# EAGLE design T04_Display_Branden (EAGLE 7.1.0)
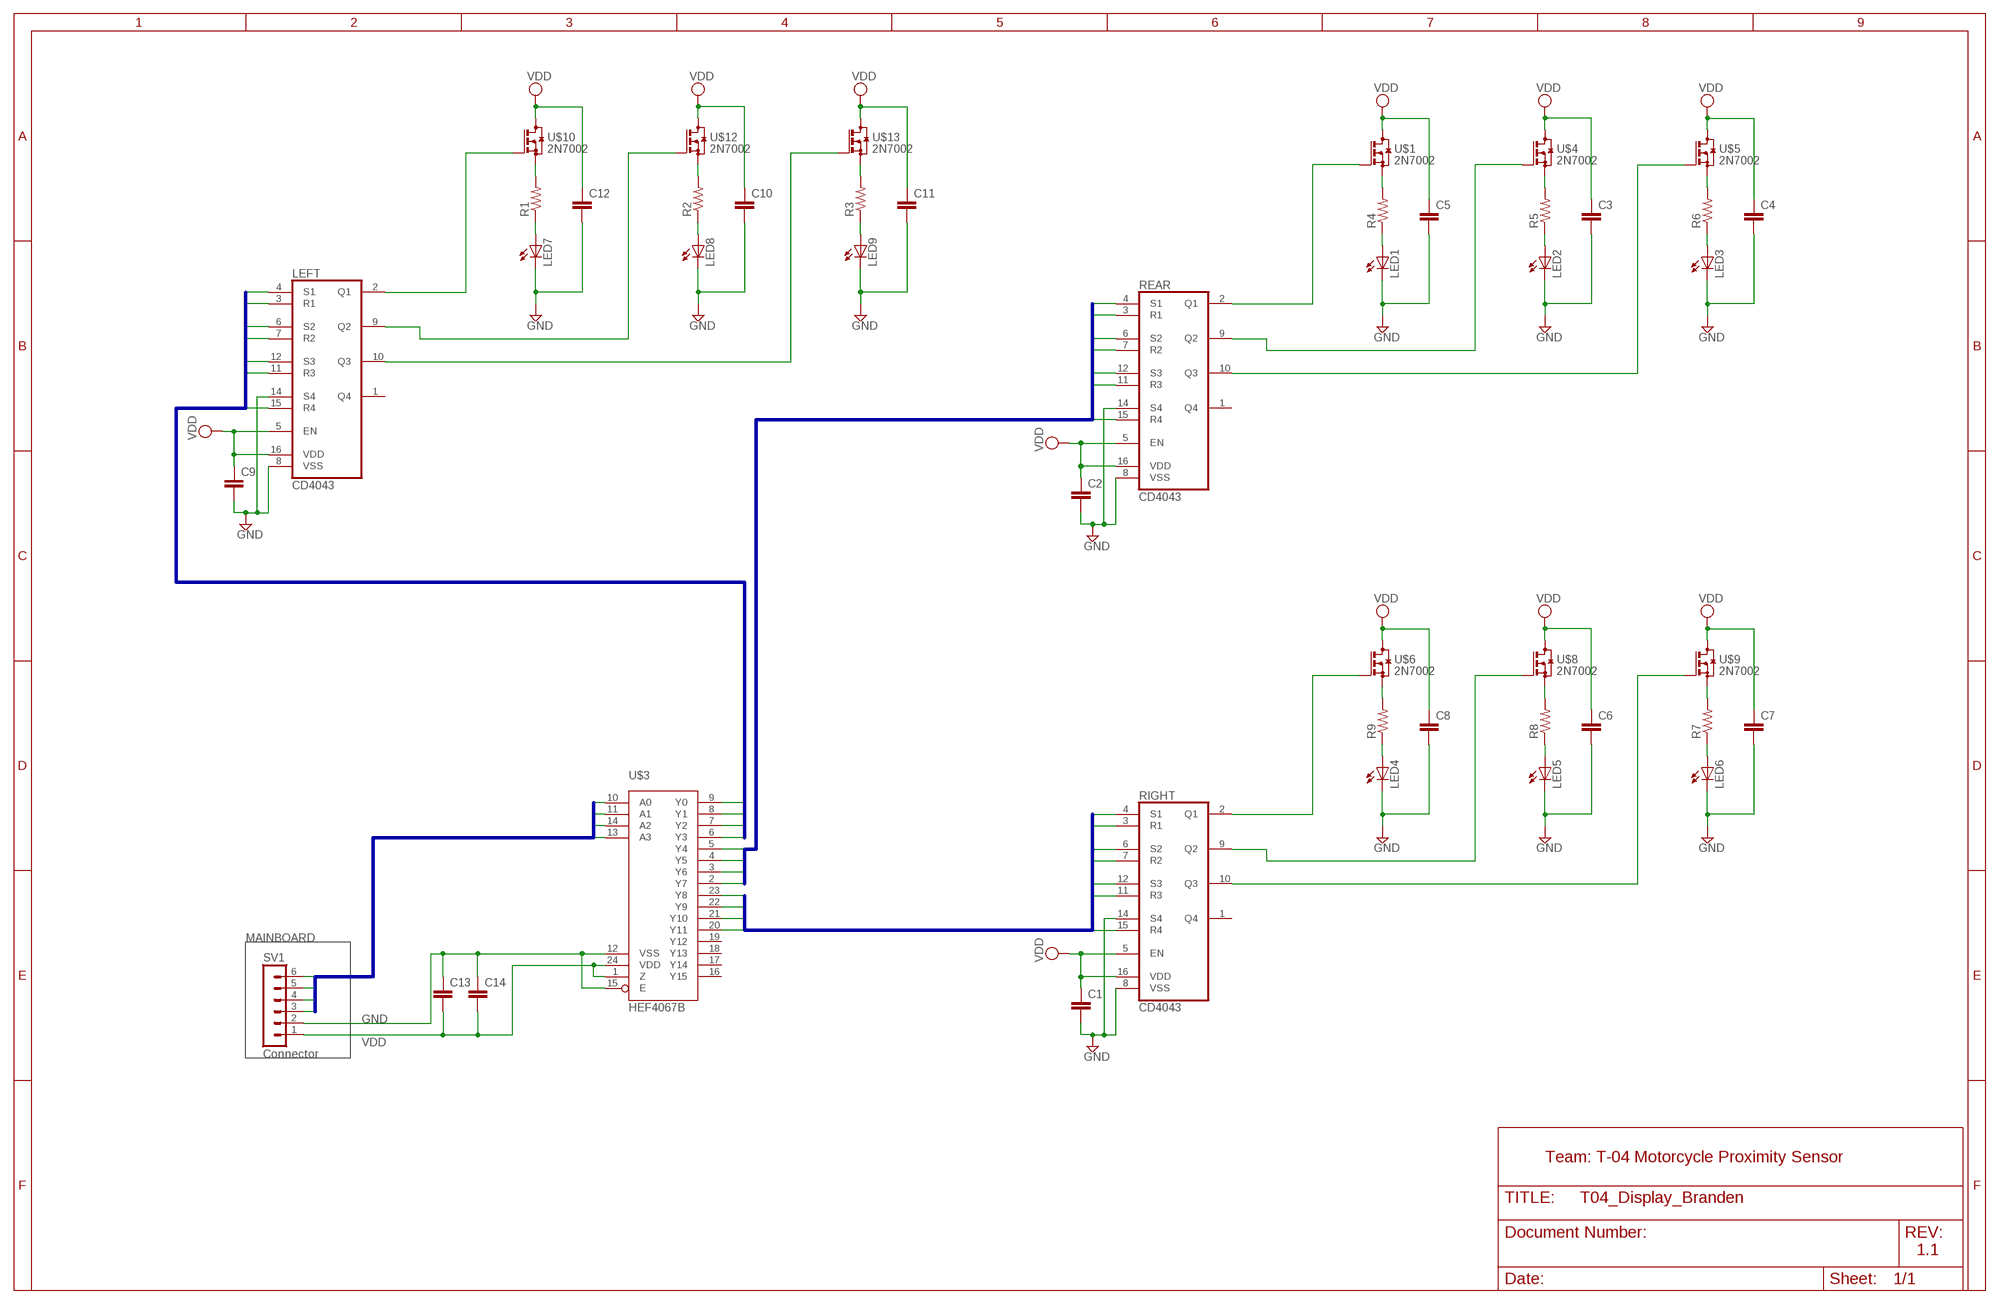
[diagram p0: schematic, sheet 1]

## Parts
C1  C-EUC1206  [C1206]
C2  C-EUC1206  [C1206]
C3  C-EUC1206  [C1206]
C4  C-EUC1206  [C1206]
C5  C-EUC1206  [C1206]
C6  C-EUC1206  [C1206]
C7  C-EUC1206  [C1206]
C8  C-EUC1206  [C1206]
C9  C-EUC1206  [C1206]
C10  C-EUC1206  [C1206]
C11  C-EUC1206  [C1206]
C12  C-EUC1206  [C1206]
C13  C-EUC1206  [C1206]
C14  C-EUC1206  [C1206]
LED1  LED3MM  [LED3MM]
LED2  LED3MM  [LED3MM]
LED3  LED3MM  [LED3MM]
LED4  LED3MM  [LED3MM]
LED5  LED3MM  [LED3MM]
LED6  LED3MM  [LED3MM]
LED7  LED3MM  [LED3MM]
LED8  LED3MM  [LED3MM]
LED9  LED3MM  [LED3MM]
LEFT  CD4043  [SOIC16N]
R1  R-US_R1206  [R1206]
R2  R-US_R1206  [R1206]
R3  R-US_R1206  [R1206]
R4  R-US_R1206  [R1206]
R5  R-US_R1206  [R1206]
R6  R-US_R1206  [R1206]
R7  R-US_R1206  [R1206]
R8  R-US_R1206  [R1206]
R9  R-US_R1206  [R1206]
REAR  CD4043  [SOIC16N]
RIGHT  CD4043  [SOIC16N]
SV1  Connector  MA06-1  [MA06-1]
U$1  2N7002  [SOT23]
U$3  HEF4067B  [SO24W]
U$4  2N7002  [SOT23]
U$5  2N7002  [SOT23]
U$6  2N7002  [SOT23]
U$8  2N7002  [SOT23]
U$9  2N7002  [SOT23]
U$10  2N7002  [SOT23]
U$12  2N7002  [SOT23]
U$13  2N7002  [SOT23]

## Nets
A0: SV1.6 U$3.10(A0)
A1: SV1.5 U$3.11(A1)
A2: SV1.4 U$3.14(A2)
A3: SV1.3 U$3.13(A3)
BG: LEFT.2(Q1) U$10.1(G)
BR: LEFT.10(Q3) U$13.1(G)
BRES: LEFT.3(R1) LEFT.7(R2) LEFT.11(R3) LEFT.15(R4) U$3.6(Y3)
BS1: LEFT.4(S1) U$3.9(Y0)
BS2: LEFT.6(S2) U$3.8(Y1)
BS3: LEFT.12(S3) U$3.7(Y2)
BY: LEFT.9(Q2) U$12.1(G)
GND: C1.2 C2.2 C3.2 C4.2 C5.2 C6.2 C7.2 C8.2 C9.2 C10.2 C11.2 C12.2 C13.1 C14.1 LED1.K(C) LED2.K(C) LED3.K(C) LED4.K(C) LED5.K(C) LED6.K(C) LED7.K(C) LED8.K(C) LED9.K(C) LEFT.8(VSS) LEFT.14(S4) REAR.8(VSS) REAR.14(S4) RIGHT.8(VSS) RIGHT.14(S4) SV1.2 U$3.12(VSS) U$3.15(E)
LG: REAR.2(Q1) U$1.1(G)
LR: REAR.10(Q3) U$5.1(G)
LRES: REAR.3(R1) REAR.7(R2) REAR.11(R3) REAR.15(R4) U$3.2(Y7)
LS1: REAR.4(S1) U$3.5(Y4)
LS2: REAR.6(S2) U$3.4(Y5)
LS3: REAR.12(S3) U$3.3(Y6)
LY: REAR.9(Q2) U$4.1(G)
N$1: R5.2 U$4.2(S)
N$2: R8.2 U$8.2(S)
N$3: R6.2 U$5.2(S)
N$4: R4.2 U$1.2(S)
N$5: LED1.A R4.1
N$6: LED3.A R6.1
N$7: R9.2 U$6.2(S)
N$8: LED4.A R9.1
N$9: LED5.A R8.1
N$10: LED2.A R5.1
N$11: R7.2 U$9.2(S)
N$12: LED6.A R7.1
N$13: R1.2 U$10.2(S)
N$14: LED7.A R1.1
N$15: R2.2 U$12.2(S)
N$16: LED8.A R2.1
N$17: R3.2 U$13.2(S)
N$18: LED9.A R3.1
RG: RIGHT.2(Q1) U$6.1(G)
RR: RIGHT.10(Q3) U$9.1(G)
RRES: RIGHT.3(R1) RIGHT.7(R2) RIGHT.11(R3) RIGHT.15(R4) U$3.20(Y11)
RS1: RIGHT.4(S1) U$3.23(Y8)
RS2: RIGHT.6(S2) U$3.22(Y9)
RS3: RIGHT.12(S3) U$3.21(Y10)
RY: RIGHT.9(Q2) U$8.1(G)
VDD: C1.1 C2.1 C3.1 C4.1 C5.1 C6.1 C7.1 C8.1 C9.1 C10.1 C11.1 C12.1 C13.2 C14.2 LEFT.5(EN) LEFT.16(VDD) REAR.5(EN) REAR.16(VDD) RIGHT.5(EN) RIGHT.16(VDD) SV1.1 U$1.3(D) U$3.1(Z) U$3.24(VDD) U$4.3(D) U$5.3(D) U$6.3(D) U$8.3(D) U$9.3(D) U$10.3(D) U$12.3(D) U$13.3(D)
Unconnected: LEFT.1(Q4) REAR.1(Q4) RIGHT.1(Q4) U$3.16(Y15) U$3.17(Y14) U$3.18(Y13) U$3.19(Y12)

## Buses
BS1,BS2,BS3,BRES
LS1,LS2,LS3,LRES
RS1,RS2,RS3,RRES
A0,A1,A2,A3

## Notes on the sheet
- MAINBOARD
- Team: T-04 Motorcycle Proximity Sensor
- 1.1

## Library data of the parts
C1-C14 = resistor:C-EU: CAPACITOR, European symbol; SPICEPREFIX: C
LED1-LED9 = display:LED: LED OSRAM: - CHIPLED LG R971, LG N971, LY N971, LG Q971, LY Q971, LO R971, LY R971 LH N974, LH R974 LS Q976, LO Q976, LY Q976 LO Q996 - Hyper CHIPLED LW Q18S LB Q993, LB Q99A, LB R99A - SideLED LS A670, LO A670, LY A670, LG A670, LP A670 LB A673, LV A673, LT A673, LW A673 LH A674 LY A675 LS A676, LA A676, LO A676, LY A676, LW A676 LS A679, LY A679, LG A679 - Hyper Micro SIDELED® LS Y876, LA Y876, LO Y876, LY Y876 LT Y87S - SmartLED LW L88C, LW L88S LB L89C, LB L89S, LG L890 LS L89K, LO L89K, LY L89K LS L896, LA L896, LO L896, LY L896 - TOPLED LS T670, LO T670, LY T670, LG T670, LP T670 LSG T670, LSP T670, LSY T670, LOP T670, LYG T670 LG T671, LOG T671, LSG T671 LB T673, LV T673, LT T673, LW T673 LH T674 LS T676, LA T676, LO T676, LY T676, LB T676, LH T676, LSB T676, LW T676 LB T67C, LV T67C, LT T67C, LS T67K, LO T67K, LY T67K, LW E67C LS E67B, LA E67B, LO E67B, LY E67B, LB E67C, LV E67C, LT E67C LW T67C LS T679, LY T679, LG T679 LS T770, LO T770, LY T770, LG T770, LP T770 LB T773, LV T773, LT T773, LW T773 LH T774 LS E675, LA E675, LY E675, LS T675 LS T776, LA T776, LO T776, LY T776, LB T776 LHGB T686 LT T68C, LB T68C - Hyper Mini TOPLED® LB M676 - Mini TOPLED Santana® LG M470 LS M47K, LO M47K, LY M47K Source: http://www.osram.convergy.de LUXEON: - LUMILED® LXK2-PW12-R00, LXK2-PW12-S00, LXK2-PW14-U00, LXK2-PW14-V00 LXK2-PM12-R00, LXK2-PM12-S00, LXK2-PM14-U00 LXK2-PE12-Q00, LXK2-PE12-R00, LXK2-PE12-S00, LXK2-PE14-T00, LXK2-PE14-U00 LXK2-PB12-K00, LXK2-PB12-L00, LXK2-PB12-M00, LXK2-PB14-N00, LXK2-PB14-P00, LXK2-PB14-Q00 LXK2-PR12-L00, LXK2-PR12-M00, LXK2-PR14-Q00, LXK2-PR14-R00 LXK2-PD12-Q00, LXK2-PD12-R00, LXK2-PD12-S00 LXK2-PH12-R00, LXK2-PH12-S00 LXK2-PL12-P00, LXK2-PL12-Q00, LXK2-PL12-R00 Source: www.luxeon.com KINGBRIGHT: KA-3528ASYC Source: www.kingbright.com
LEFT REAR RIGHT = display:CD4043
R1-R9 = rcl:R-US_: RESISTOR, American symbol
SV1 = con-lstb:MA06-1: PIN HEADER; OC_FARNELL: unknown; OC_NEWARK: unknown
U$1 U$4-U$6 U$8-U$10 U$12 U$13 = display:2N7002: 2N7002 nMOS
U$3 = display:HEF4067B

## Board
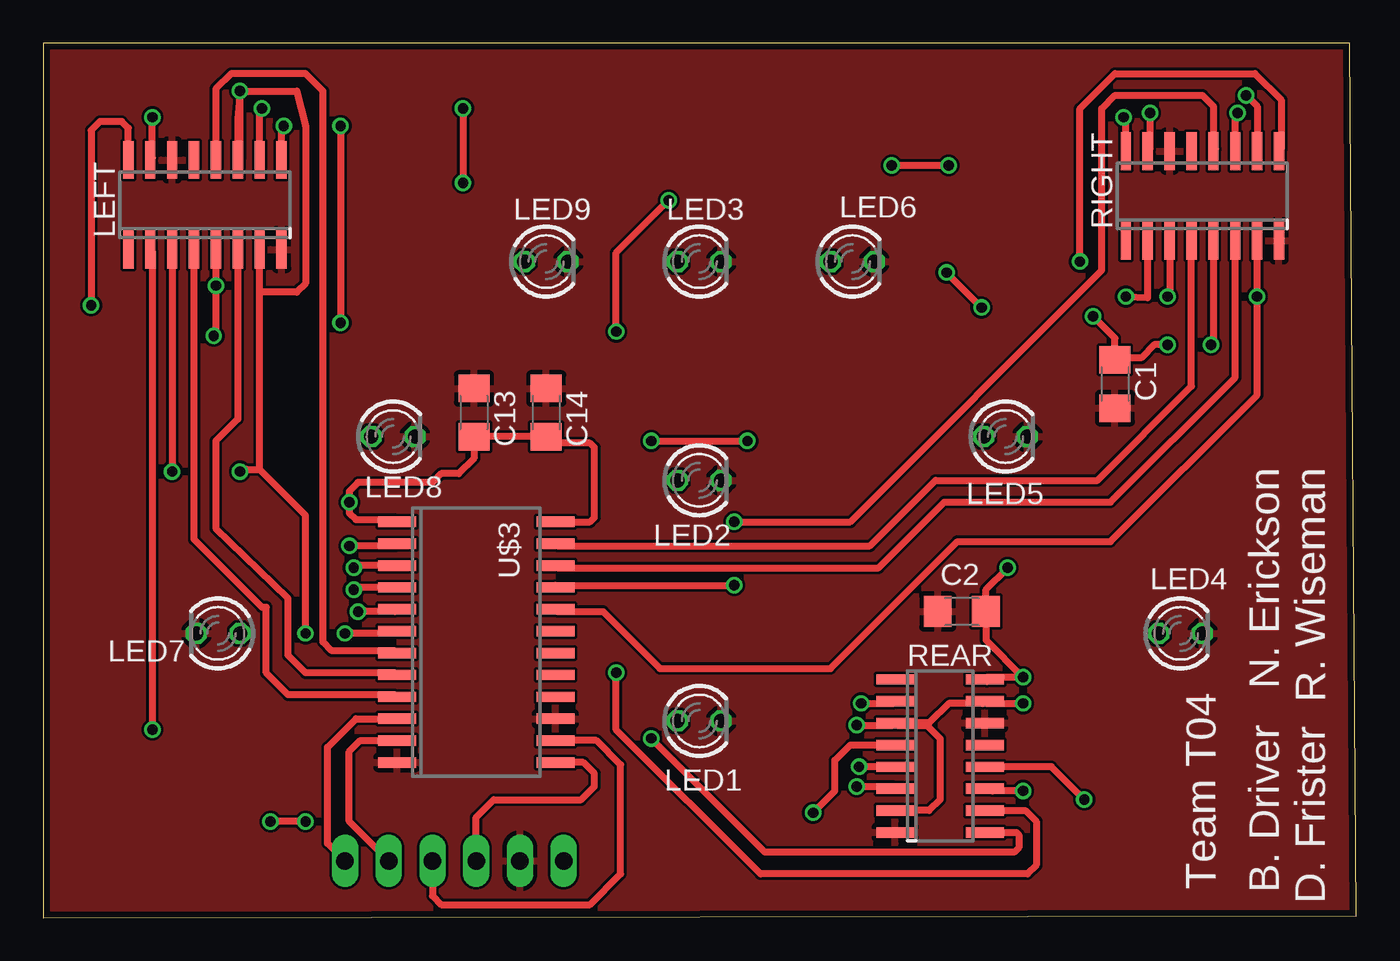
[diagram p1: board, top side]
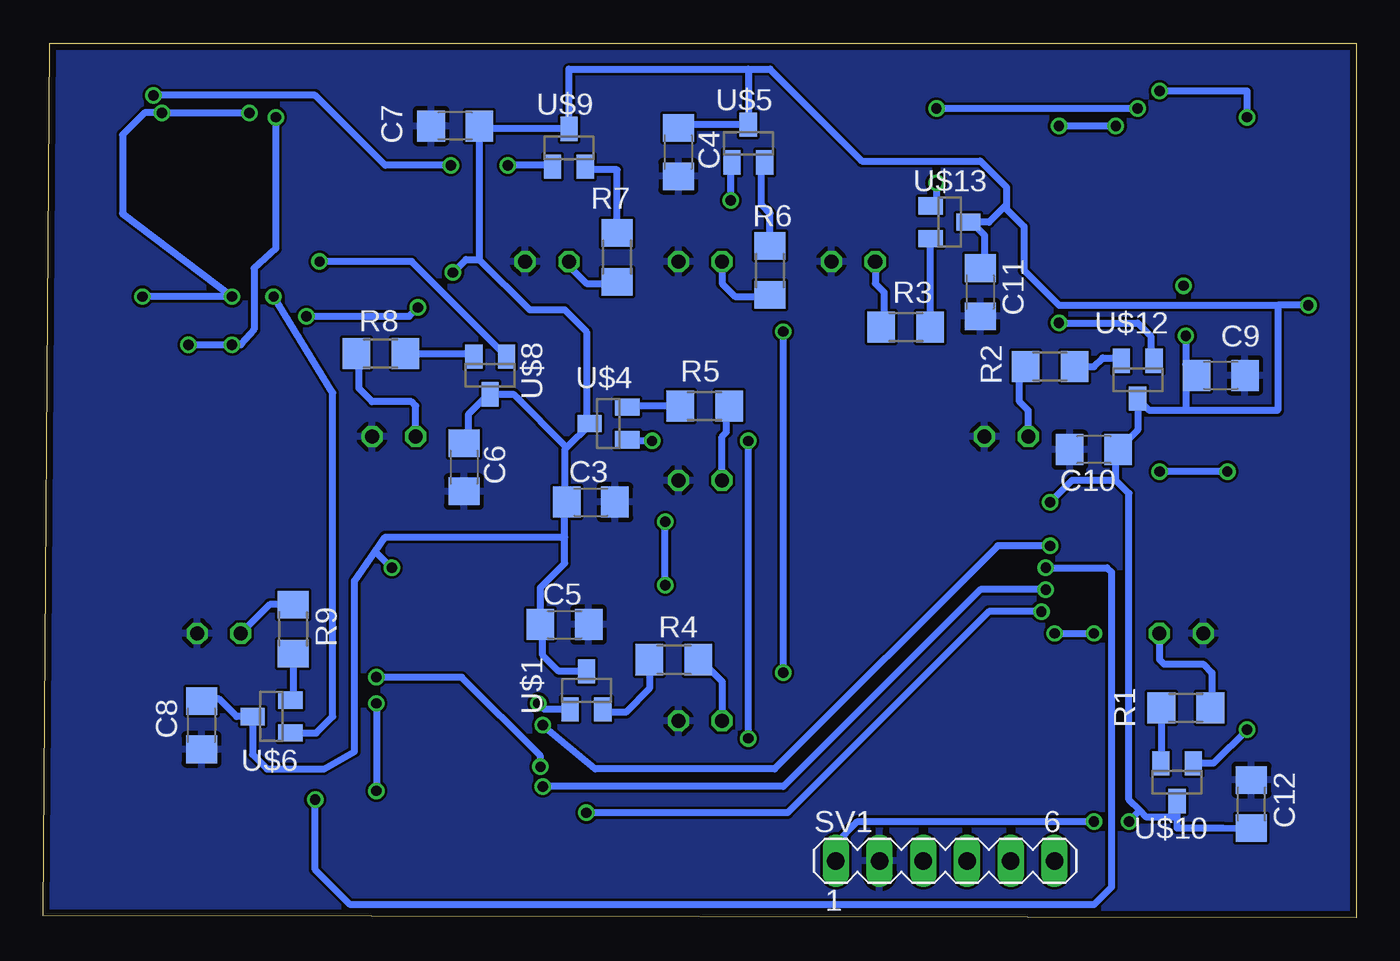
[diagram p2: board, bottom side, seen from below]

Size 76.25 x 50.79 mm. Coordinates in mm from the lower left corner, seen from the top.
Outline: 0,0 76.25,0.13 75.87,50.79 0,50.79 0,0
Copper layers (1*16): Top 0.0356mm / dielectric 1.5011mm / Bottom 0.0356mm
Design rules "OSH-Park-2-layer": minimum track width 6mil, minimum drill 13mil, track to track 6mil, track to pad 6mil, pad to pad 6mil, via to via 6mil, smd to smd 6mil, copper to edge 15mil, drill to drill 6mil, minimum pad ring 7mil, minimum via ring 7mil, stop-mask expansion 3mil, vias tented up to drill 0mil, thermal gap 10mil

### Footprints (pad centres in the part's own frame; a part is rotated, then mirrored left to right if it is on the bottom)
C1206 = smd 1.6 x 1.8: 1 -1.4,0; 2 1.4,0
LED3MM = drill 0.813 octagon: A -1.27,0; K 1.27,0
SOIC16N = smd 0.6 x 2.2: 1 -4.445,-2.6; 2 -3.175,-2.6; 3 -1.905,-2.6; 4 -0.635,-2.6; 5 0.635,-2.6; 6 1.905,-2.6; 7 3.175,-2.6; 8 4.445,-2.6; 9 4.445,2.6; 10 3.175,2.6; 11 1.905,2.6; 12 0.635,2.6; 13 -0.635,2.6; 14 -1.905,2.6; 15 -3.175,2.6; 16 -4.445,2.6
R1206 = smd 1.6 x 1.803: 1 -1.422,0; 2 1.422,0
MA06-1 = drill 1.016 long: 1 -6.35,0; 2 -3.81,0; 3 -1.27,0; 4 1.27,0; 5 3.81,0; 6 6.35,0
SOT23 = smd 1 x 1.4: 1 -0.95,-1.1; 2 0.95,-1.1; 3 0,1.1
SO24W = smd 0.6 x 2.2: 1 -6.985,-4.6; 2 -5.715,-4.6; 3 -4.445,-4.6; 4 -3.175,-4.6; 5 -1.905,-4.6; 6 -0.635,-4.6; 7 0.635,-4.6; 8 1.905,-4.6; 9 3.175,-4.6; 10 4.445,-4.6; 11 5.715,-4.6; 12 6.985,-4.6; 13 6.985,4.6; 14 5.715,4.6; 15 4.445,4.6; 16 3.175,4.6; 17 1.905,4.6; 18 0.635,4.6; 19 -0.635,4.6; 20 -1.905,4.6; 21 -3.175,4.6; 22 -4.445,4.6; 23 -5.715,4.6; 24 -6.985,4.6

### Placement (x,y rotation side)
C1  62.23,30.99 270 top
C2  53.34,17.78 180 top
C3  44.45,24.13 0 bottom
C4  39.37,44.45 270 bottom
C5  45.97,17.02 0 bottom
C6  51.82,26.16 270 bottom
C7  52.32,45.97 180 bottom
C8  67.06,11.18 270 bottom
C9  7.87,31.5 0 bottom
C10  15.24,27.18 180 bottom
C11  21.84,36.32 270 bottom
C12  6.1,6.6 90 bottom
C13  25.02,29.34 270 top
C14  29.21,29.34 270 top
LED1  38.1,11.43 0 top
LED2  38.1,25.4 0 top
LED3  38.1,38.1 0 top
LED4  66.04,16.51 0 top
LED5  55.88,27.94 0 top
LED6  46.99,38.1 0 top
LED7  10.16,16.51 180 top
LED8  20.32,27.94 0 top
LED9  29.21,38.1 0 top
LEFT  9.4,41.4 0 top
R1  9.91,12.19 180 bottom
R2  17.78,32 0 bottom
R3  26.16,34.29 0 bottom
R4  39.62,14.99 180 bottom
R5  37.85,29.72 180 bottom
R6  34.04,37.59 90 bottom
R7  42.93,38.35 90 bottom
R8  56.64,32.77 0 bottom
R9  61.72,16.76 270 bottom
REAR  52.07,9.4 270 top
RIGHT  67.31,41.91 0 top
SV1  23.88,3.3 0 bottom
U$1  44.7,13.21 0 bottom
U$3  25.15,16 270 top
U$4  43.43,28.7 90 bottom
U$5  35.31,44.96 0 bottom
U$6  62.99,11.68 90 bottom
U$8  50.29,31.5 180 bottom
U$9  45.72,44.7 0 bottom
U$10  10.41,7.87 180 bottom
U$12  12.7,31.24 180 bottom
U$13  23.62,40.39 270 bottom

### Tracks (layer width: path | path; a pad name or v marks a point on that pad's centre or on a via)
A0
  Top 0.406: SV1.6 16.51,4.32 16.51,9.91 18.16,11.56 U$3.10
A1
  Top 0.406: SV1.5 17.78,5.59 17.78,9.65 18.41,10.29 U$3.11
A2
  Top 0.406: SV1.4 22.61,1.27 23.11,0.76 31.75,0.76 33.53,2.54 33.53,8.89 32.13,10.29 U$3.14
A3
  Top 0.406: SV1.3 25.15,5.84 26.16,6.86 31.24,6.86 32,7.62 32,8.38 31.37,9.02 U$3.13
BG  (via drill 0.6)
  Top 0.406: LEFT.2 6.35,38.67 v6.35,10.92
  Bottom 0.406: v6.35,10.92 8.3,8.97 U$10.1
BR  (via drill 0.6)
  Top 0.406: LEFT.10 12.57,46.86 v12.7,46.99 | v24.38,46.99 v24.38,42.67
  Bottom 0.406: v12.7,46.99 v24.38,46.99 | v24.38,42.67 24.38,41.67 U$13.1
BRES  (via drill 0.6)
  Top 0.406: U$3.6 20.42,16.51 v17.53,16.51 | v15.24,16.51 15.24,23.37 12.57,26.04 | 12.57,26.04 12.57,36.32 | 12.57,36.32 LEFT.7 | LEFT.15 6.35,44.13 v6.35,46.48 | v11.43,48.01 11.3,46.35 LEFT.11 11.43,44.13 v11.43,48.01 | v11.43,48.01 14.73,48.01 15.24,45.97 15.24,36.83 14.73,36.32 12.57,36.32 | LEFT.3 v7.49,25.91 | v11.43,25.91 11.81,26.04 12.57,26.04
  Bottom 0.406: v17.53,16.51 v15.24,16.51 | v6.35,46.48 6.35,48.01 v11.43,48.01 | v7.49,25.91 v11.43,25.91
BS1
  Top 0.406: U$3.9 20.42,12.95 14.22,12.95 12.95,14.22 12.95,18.03 12.7,18.03 8.76,21.97 LEFT.4
BS2
  Top 0.406: U$3.8 20.42,14.22 15.24,14.22 14.22,15.24 14.22,18.54 10.03,22.61 10.03,27.69 11.3,28.96 LEFT.6
BS3
  Top 0.406: U$3.7 20.42,15.49 16.76,15.49 16.26,16 16.26,48.01 15.24,49.02 10.92,49.02 10.03,48.13 LEFT.12
BY  (via drill 0.6)
  Top 0.406: LEFT.9 13.84,45.85 v13.97,45.97 | v17.27,45.97 v17.27,34.54
  Bottom 0.406: v13.97,45.97 v17.27,45.97 | v17.27,34.54 12.7,34.54 11.94,33.78 11.94,32.53 U$12.1
GND
  pour Bottom: 0,0 0,50.8 75.95,50.8 76.33,0
  pour Top: 0,0 0,50.8 76.2,50.8 76.2,0
LG  (via drill 0.6)
  Top 0.406: v47.5,12.45 49.34,12.45 REAR.2
  Bottom 0.406: U$1.1 47.16,12.11 v47.5,12.45
LR  (via drill 0.6)
  Top 0.406: REAR.10 57.02,6.22 57.66,5.59 57.66,3.05 57.15,2.54 41.66,2.54 33.27,10.92 v33.27,14.22 | v33.27,34.04 33.27,38.61 v36.32,41.66
  Bottom 0.406: v33.27,14.22 v33.27,34.04 | v36.32,41.66 36.32,43.79 U$5.1
LRES  (via drill 0.6)
  Top 0.406: v56.9,12.45 54.8,12.45 REAR.15 54.54,12.45 52.58,12.45 51.44,11.3 REAR.3 | v56.9,7.37 55.12,7.37 54.99,7.49 REAR.11 | REAR.3 49.6,11.18 51.31,11.18 52.07,10.41 52.07,6.86 51.44,6.22 REAR.7 | U$3.2 arc-90 20.42,21.59 v17.78,21.59 | v47.24,11.18 49.34,11.18 REAR.3
  Bottom 0.406: v56.9,12.45 v56.9,7.37 | v17.78,21.59 20.83,21.59 33.78,8.64 44.2,8.64 v47.24,11.18
LS1  (via drill 0.6)
  Top 0.406: U$3.5 20.42,17.78 v18.29,17.78 | v44.7,6.1 45.97,7.37 45.97,9.14 46.86,10.03 REAR.4
  Bottom 0.406: v18.29,17.78 21.34,17.78 33.02,6.1 v44.7,6.1
LS2  (via drill 0.6)
  Top 0.406: U$3.4 18.16,19.18 v18.03,19.05 | v47.24,7.62 49.34,7.62 REAR.6
  Bottom 0.406: v18.03,19.05 21.84,19.05 33.27,7.62 v47.24,7.62
LS3  (via drill 0.6)
  Top 0.406: U$3.3 18.16,20.45 v18.03,20.32 | v60.45,6.86 58.55,8.76 REAR.12
  Bottom 0.406: v18.03,20.32 14.48,20.32 14.22,20.07 14.22,1.78 15.24,0.76 58.42,0.76 60.45,2.79 v60.45,6.86
LY  (via drill 0.6)
  Top 0.406: REAR.9 56.52,4.95 56.64,4.83 56.64,4.06 56.39,3.81 41.91,3.81 v35.31,10.41 | v35.31,27.69 v40.89,27.69
  Bottom 0.406: v35.31,10.41 v35.31,27.69 | v40.89,27.69 42.27,27.69 U$4.1
N$1
  Bottom 0.406: R5.2 42.27,29.72 U$4.2
N$2
  Bottom 0.406: R8.2 51.41,32.77 U$8.2
N$3
  Bottom 0.406: R6.2 34.04,40.89 34.54,41.4 34.54,43.67 U$5.2
N$4
  Bottom 0.406: R4.2 41.05,13.31 42.42,11.94 43.58,11.94 U$1.2
N$5
  Bottom 0.406: R4.1 38.1,14.99 36.83,13.72 LED1.A
N$6
  Bottom 0.406: LED3.A 36.83,36.83 36.07,36.07 34.14,36.07 R6.1
N$7
  Bottom 0.406: R9.2 61.72,12.8 U$6.2
N$8
  Bottom 0.406: R9.1 63.09,18.19 LED4.A
N$9
  Bottom 0.406: LED5.A 54.61,29.72 54.86,29.97 57.15,29.97 57.91,30.73 57.91,32.61 R8.1
N$10
  Bottom 0.406: LED2.A 36.83,27.94 36.58,28.19 36.58,29.57 R5.1
N$11
  Bottom 0.406: R7.2 42.93,43.43 44.6,43.43 U$9.2
N$12
  Bottom 0.406: LED6.A 45.72,37.85 44.7,36.83 43.03,36.83 R7.1
N$13
  Bottom 0.406: R1.2 11.33,9.01 U$10.2
N$14
  Bottom 0.406: LED7.A 11.43,14.99 11.18,14.73 8.89,14.73 8.38,14.22 8.38,12.29 R1.1
N$15
  Bottom 0.406: R2.2 15.24,32 14.73,32.51 13.82,32.51 U$12.2
N$16
  Bottom 0.406: LED8.A 19.05,29.46 19.56,29.97 19.56,31.65 R2.1
N$17
  Bottom 0.406: R3.2 24.74,39.42 U$13.2
N$18
  Bottom 0.406: LED9.A 27.94,36.83 27.43,36.32 27.43,34.44 R3.1
RG  (via drill 0.6)
  Top 0.406: v62.87,36.07 64.14,36.01 RIGHT.2
  Bottom 0.406: U$6.1 60.39,10.73 59.44,11.68 59.44,30.48 v62.87,36.07
RR  (via drill 0.6)
  Top 0.406: v49.28,43.69 v52.58,43.69 | v69.85,47.75 70.48,47.12 RIGHT.10
  Bottom 0.406: U$9.1 46.75,43.69 v49.28,43.69 | v52.58,43.69 56.39,43.69 60.45,47.75 v69.85,47.75
RRES  (via drill 0.6)
  Top 0.406: U$3.20 29.87,17.78 32.51,17.78 35.81,14.48 45.72,14.48 53.09,21.84 61.98,21.84 70.48,30.35 v70.48,36.07 RIGHT.7 | RIGHT.3 65.41,36.07 v65.28,36.07 | v64.26,46.74 64.26,44.64 RIGHT.15 | RIGHT.11 69.22,46.61 v69.34,46.74
  Bottom 0.406: v70.48,36.07 v65.28,36.07 71.63,40.89 71.63,45.47 70.36,46.74 v69.34,46.74 v64.26,46.74
RS1
  Top 0.406: U$3.23 29.87,21.59 48.01,21.59 51.82,25.4 61.21,25.4 66.67,30.86 RIGHT.4
RS2
  Top 0.406: U$3.22 29.87,20.32 48.51,20.32 52.32,24.13 61.98,24.13 69.22,31.37 RIGHT.6
RS3  (via drill 0.6)
  Top 0.406: U$3.21 29.75,19.3 v40.13,19.3 | v40.13,22.99 46.86,22.99 61.47,37.59 61.47,46.99 62.23,47.75 67.31,47.75 67.94,47.12 RIGHT.12 68.07,44.64
  Bottom 0.406: v40.13,19.3 v40.13,22.99
RY  (via drill 0.6)
  Top 0.406: v60.2,38.1 60.2,46.99 62.23,49.02 70.36,49.02 71.88,47.5 71.88,44.64 RIGHT.9
  Bottom 0.406: U$8.1 54.85,38.1 v60.2,38.1
VDD  (via drill 0.6)
  Top 0.406: 54.8,13.72 REAR.16 54.8,13.97 v56.9,13.97 54.74,16.13 C2.1 54.74,19.05 v56.01,20.32 | RIGHT.5 67.94,33.4 v67.82,33.27 | v65.28,33.27 64.52,33.27 63.75,32.51 62.35,32.51 C1.1 62.23,33.66 v60.96,34.92 | RIGHT.16 62.87,46.35 v62.74,46.48 | v15.24,5.59 v13.21,5.59 | LEFT.5 v10.03,36.7 10.03,33.91 v9.91,33.78 | LEFT.16 4.95,45.85 4.57,46.23 3.3,46.23 2.79,45.72 v2.79,35.56 | REAR.5 v47.37,8.76 | U$3.24 31.75,22.99 32,23.24 32,27.3 31.75,27.56 29.59,27.56 C14.2 C13.2 25.02,26.67 24.13,25.78 23.11,25.78 22.61,25.27 18.29,25.27 17.78,24.77 v17.78,24.13 17.78,23.5 18.16,23.11 20.42,23.11 U$3.1 | v54.48,35.43 v52.45,37.47
  Bottom 0.406: C8.1 66.93,12.7 66.04,12.7 65.02,11.68 U$6.3 64.09,9.48 63.25,8.64 59.94,8.64 58.17,9.65 58.17,19.56 56.97,21.27 | C6.1 51.56,27.82 51.56,29.21 50.38,30.4 U$8.3 48.94,30.4 45.85,27.3 | 45.85,27.3 44.53,28.62 U$4.3 44.7,28.87 44.7,34.04 45.97,35.31 48.01,35.31 50.92,38.22 | 45.85,27.3 45.97,27.18 45.97,24.25 C3.1 45.97,24.01 45.97,22.1 | C4.1 39.16,46.06 U$5.3 35.31,49.28 | C11.1 21.59,37.98 21.59,39.62 22.35,40.39 U$13.3 21.34,40.39 20.32,41.4 | 10.41,5.84 10.41,5.21 7.74,5.21 C12.1 | 35.31,49.28 45.72,49.28 U$9.3 50.75,45.8 C7.1 50.92,38.22 | 35.31,49.28 34.04,49.28 28.7,43.94 21.84,43.94 20.32,42.42 20.32,41.4 | 20.32,41.4 20.32,41.15 19.3,40.13 19.3,37.59 17.27,35.56 4.57,35.56 | 4.57,35.56 4.57,29.46 9.91,29.46 | 9.91,29.46 12.02,29.46 U$12.3 12.7,28.32 C10.1 13.97,27.05 13.97,25.4 | U$10.3 10.41,5.84 | 10.41,5.84 12.19,5.84 12.57,6.22 | 12.57,6.22 13.21,6.86 13.21,24.64 13.97,25.4 | U$1.3 46.31,14.31 47.24,15.24 47.24,16.89 C5.1 47.37,19.17 45.97,20.57 45.97,22.1 | 56.97,21.27 56.39,22.1 45.97,22.1 | v67.82,33.27 v65.28,33.27 64.77,33.27 64.01,34.16 64.01,37.72 62.74,38.86 v62.74,46.48 | SV1.1 30.23,4.32 28.96,5.59 v15.24,5.59 | v13.21,5.59 12.57,6.22 | v9.91,33.78 9.91,32.13 | 9.91,32.13 C9.1 | v2.79,35.56 4.57,35.56 | 9.91,32.13 9.91,29.46 | v47.37,8.76 47.37,9.4 51.94,13.97 v56.9,13.97 | v56.01,20.32 v56.02,20.32 56.97,21.27 | 13.97,25.4 16.51,25.4 v17.78,24.13 | v60.96,34.92 54.99,34.92 v54.48,35.43 | v52.45,37.47 51.69,38.22 50.92,38.22

### Text on the board
tNames: B. Driver N. Erickson / D. Frister R. Wiseman | Team T04